# Altium project MKS_GEN_V14.PrjPCB
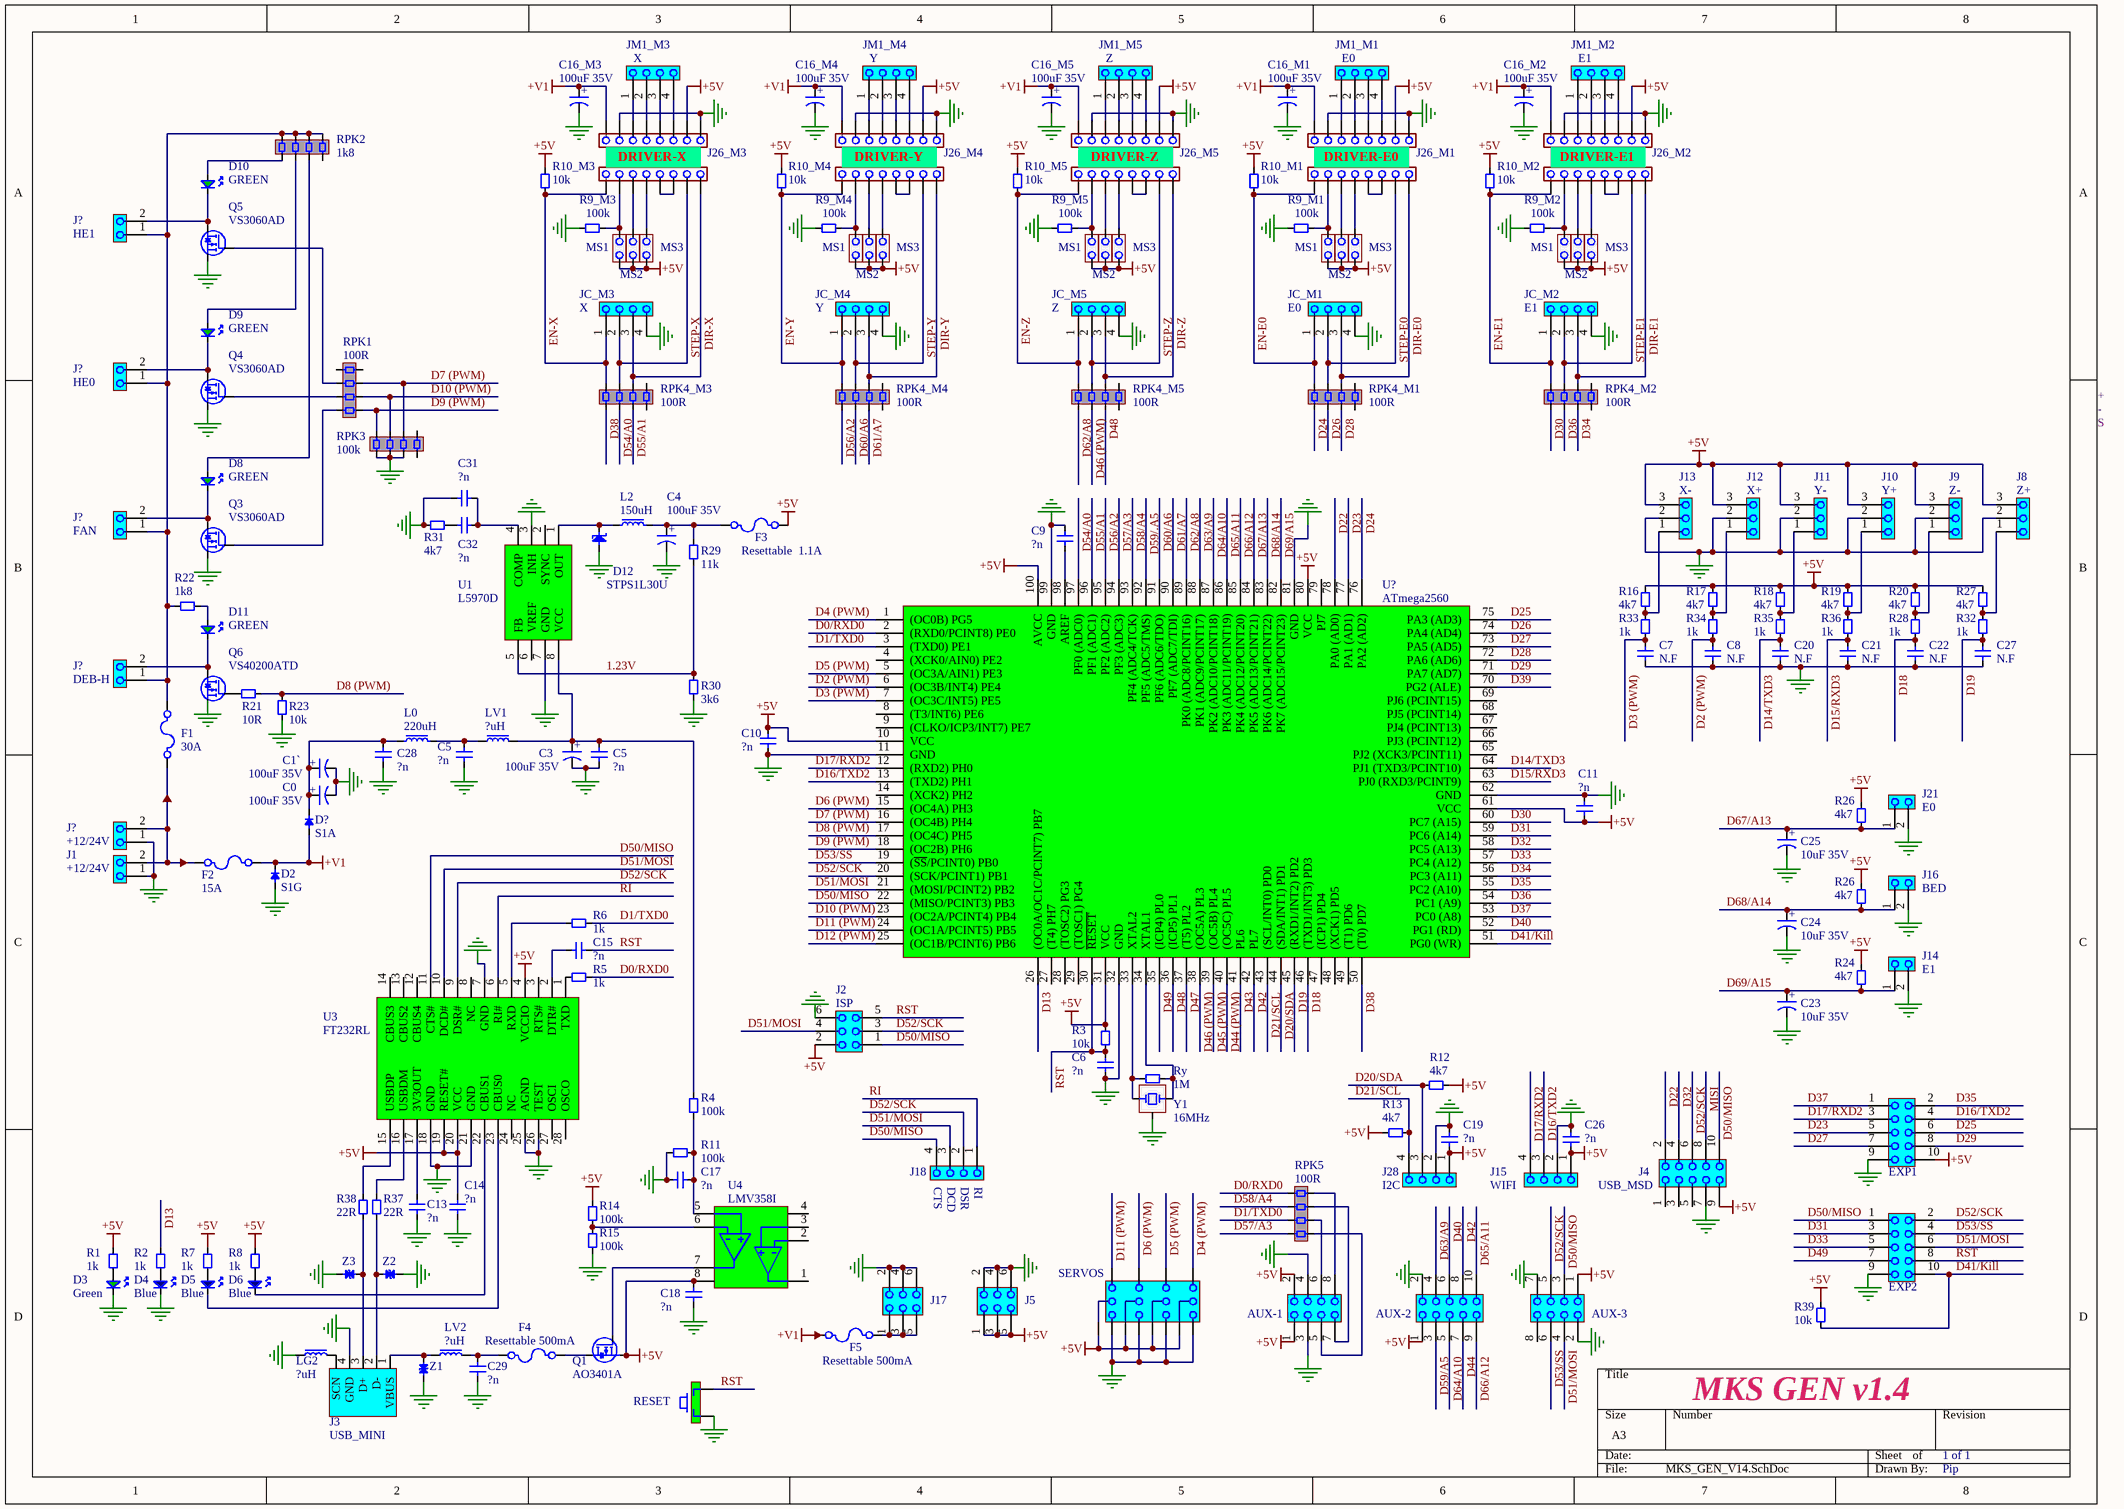
[diagram p0: MKS_GEN_V14.SchDoc]
1 sheet, 191 parts. Net scope: global (net labels, ports and power ports of the same name join across sheets).

## Sheet MKS_GEN_V14.SchDoc
size A3

### Parts
(Parts that share a designator on the sheet are numbered #1, #2 ... from top to bottom, then left to right.)
C0  100uF 35V
C1`  100uF 35V
C3  100uF 35V
C4  100uF 35V
C5#1  ?n  [CC0603]
C5#2  ?n  [CC0603]
C6  ?n  [CC0603]
C7  N.F  [CC0603]
C8  N.F  [CC0603]
C9  ?n  [CC0603]
C10  ?n  [CC0603]
C11  ?n  [CC0603]
C13  ?n  [CC0603]
C14  ?n  [CC0603]
C15  ?n  [CC0603]
C16_M1  100uF 35V  [Cap Case Code AVX C]
C16_M2  100uF 35V  [Cap Case Code AVX C]
C16_M3  100uF 35V  [Cap Case Code AVX C]
C16_M4  100uF 35V  [Cap Case Code AVX C]
C16_M5  100uF 35V  [Cap Case Code AVX C]
C17  ?n  [CC0603]
C18  ?n  [CC0603]
C19  ?n  [CC0603]
C20  N.F  [CC0603]
C21  N.F  [CC0603]
C22  N.F  [CC0603]
C23  10uF 35V
C24  10uF 35V
C25  10uF 35V
C26  ?n  [CC0603]
C27  N.F  [CC0603]
C28  ?n  [CC0603]
C29  ?n  [CC0603]
C31  ?n  [CC0603]
C32  ?n  [CC0603]
CONN?#1  EXP1
CONN?#2  EXP2
CONN?#3  SERVOS
CONN?#4  AUX-1
CONN?#5  AUX-2
CONN?#6  AUX-3
D2  S1G
D3  Green  [SMT_LED]
D4  Blue  [SMT_LED]
D5  Blue  [SMT_LED]
D6  Blue  [SMT_LED]
D8  GREEN  [SMT_LED]
D9  GREEN  [SMT_LED]
D10  GREEN  [SMT_LED]
D11  GREEN  [SMT_LED]
D12  STPS1L30U
D?  S1A
F1  30A
F2  15A
F3  Resettable  1.1A
F4  Resettable 500mA
F5  Resettable 500mA
J1  +12/24V
J2  ISP
J3  USB_MINI
J4  USB_MSD
J5  ?  (value not drawn)
J8  Z+
J9  Z-
J10  Y+
J11  Y-
J12  X+
J13  X-
J14  E1
J15  WIFI
J16  BED
J17  ?  (value not drawn)
J18  WIFI  (value not drawn)
J21  E0
J26_M1  Header 8 0.1  (value not drawn)
J26_M2  Header 8 0.1  (value not drawn)
J26_M3  Header 8 0.1  (value not drawn)
J26_M4  Header 8 0.1  (value not drawn)
J26_M5  Header 8 0.1  (value not drawn)
J28  I2C
J?#1  HE1
J?#2  HE0
J?#3  FAN
J?#4  DEB-H
J?#5  +12/24V
JC_M1  E0
JC_M2  E1
JC_M3  X
JC_M4  Y
JC_M5  Z
JM1_M1  E0
JM1_M2  E1
JM1_M3  X
JM1_M4  Y
JM1_M5  Z
JP?#1  Header 8 0.1  (value not drawn)
JP?#2  Header 8 0.1  (value not drawn)
JP?#3  Header 8 0.1  (value not drawn)
JP?#4  Header 8 0.1  (value not drawn)
JP?#5  Header 8 0.1  (value not drawn)
JP?#6  MS1  [sip2 - 0.1"]
JP?#7  MS2  [sip2 - 0.1"]
JP?#8  MS3  [sip2 - 0.1"]
JP?#9  MS1  [sip2 - 0.1"]
JP?#10  MS2  [sip2 - 0.1"]
JP?#11  MS3  [sip2 - 0.1"]
JP?#12  MS1  [sip2 - 0.1"]
JP?#13  MS2  [sip2 - 0.1"]
JP?#14  MS3  [sip2 - 0.1"]
JP?#15  MS1  [sip2 - 0.1"]
JP?#16  MS2  [sip2 - 0.1"]
JP?#17  MS3  [sip2 - 0.1"]
JP?#18  MS1  [sip2 - 0.1"]
JP?#19  MS2  [sip2 - 0.1"]
JP?#20  MS3  [sip2 - 0.1"]
L0  220uH  [Inductor CDRH3D11HPNP]
L2  150uH  [Inductor CDRH3D11HPNP]
LG2  ?uH  [Murata Coil]
LV1  ?uH  [Murata Coil]
LV2  ?uH  [Murata Coil]
Q1  AO3401A  [SOT-23]
Q3  VS3060AD
Q4  VS3060AD
Q5  VS3060AD
Q6  VS40200ATD
R1  1k  [RES603N]
R2  1k  [RES603N]
R3  10k  [RES603N]
R4  100k  [RES603N]
R5  1k  [RES603N]
R6  1k  [RES603N]
R7  1k  [RES603N]
R8  1k  [RES603N]
R9_M1  100k  [RES603N]
R9_M2  100k  [RES603N]
R9_M3  100k  [RES603N]
R9_M4  100k  [RES603N]
R9_M5  100k  [RES603N]
R10_M1  10k  [RES603N]
R10_M2  10k  [RES603N]
R10_M3  10k  [RES603N]
R10_M4  10k  [RES603N]
R10_M5  10k  [RES603N]
R11  100k  [RES603N]
R12  4k7  [RES603N]
R13  4k7  [RES603N]
R14  100k  [RES603N]
R15  100k  [RES603N]
R16  4k7  [RES603N]
R17  4k7  [RES603N]
R18  4k7  [RES603N]
R19  4k7  [RES603N]
R20  4k7  [RES603N]
R21  10R  [RES603N]
R22  1k8  [RES603N]
R23  10k  [RES603N]
R24  4k7  [RES603N]
R26#1  4k7  [RES603N]
R26#2  4k7  [RES603N]
R27  4k7  [RES603N]
R28  1k  [RES603N]
R29  11k  [RES603N]
R30  3k6  [RES603N]
R31  4k7  [RES603N]
R32  1k  [RES603N]
R33  1k  [RES603N]
R34  1k  [RES603N]
R35  1k  [RES603N]
R36  1k  [RES603N]
R37  22R  [RES603N]
R38  22R  [RES603N]
R39  10k  [RES603N]
RPK1  100R  [TC164]
RPK2  1k8  [TC164]
RPK3  100k  [TC164]
RPK4_M1  100R  [TC164]
RPK4_M2  100R  [TC164]
RPK4_M3  100R  [TC164]
RPK4_M4  100R  [TC164]
RPK4_M5  100R  [TC164]
RPK5  100R  [TC164]
Ry  1M  [RES603N]
SW??  RESET
U1  L5970D  [TSSOP8]
U3  FT232RL
U4  LMV358I  [SOIC8_N]
U?  ATmega2560
Y1  16MHz
Z1  ?  (value not drawn)
Z2  ?  (value not drawn)
Z3  ?  (value not drawn)

### Nets
+5V: C10.2 C11.1 C14.1 C18.2 C19.1 C26.1 CONN?#1.10 CONN?#4.1 CONN?#4.2 CONN?#5.1 CONN?#6.1 F3.2 J2.2 J4.9 J5.1 J5.3 J5.5 J8.3 J9.3 J10.3 J11.3 J12.3 J13.3 J15.1 J26_M1.7 J26_M2.7 J26_M3.7 J26_M4.7 J26_M5.7 J28.1 JP?#6.1 JP?#7.1 JP?#8.1 JP?#9.1 JP?#10.1 JP?#11.1 JP?#12.1 JP?#13.1 JP?#14.1 JP?#15.1 JP?#16.1 JP?#17.1 JP?#18.1 JP?#19.1 JP?#20.1 Q1.2(S) R1.2 R3.2 R7.2 R8.2 R10_M1.1 R10_M2.1 R10_M3.1 R10_M4.1 R10_M5.1 R12.2 R13.2 R14.1 R16.2 R17.2 R18.2 R19.2 R20.2 R24.2 R26#1.2 R26#2.2 R27.2 R39.2 U3.4(VCCIO) U3.19(RESET#) U3.20(VCC) U4.8(VCC) U?.10(VCC) U?.31(VCC) U?.61(VCC) U?.80(VCC) U?.100(AVCC)
+V1: C16_M1.1 C16_M2.1 C16_M3.1 C16_M4.1 C16_M5.1 D2.1 D?.2 F2.2 F5.1 J26_M1.1 J26_M2.1 J26_M3.1 J26_M4.1 J26_M5.1
GND: C0.2 C1`.2 C3.2 C4.2 C5#1.1 C5#2.1 C6.1 C7.1 C8.1 C9.2 C10.1 C11.2 C13.2 C14.2 C16_M1.2 C16_M2.2 C16_M3.2 C16_M4.2 C16_M5.2 C17.2 C18.1 C19.2 C20.1 C21.1 C22.1 C23.2 C24.2 C25.2 C26.2 C27.1 C28.1 C29.1 C31.2 CONN?#1.9 CONN?#2.9 CONN?#4.3 CONN?#4.4 CONN?#5.2 CONN?#6.2 CONN?#6.7 D2.2 D3.2(K) D4.2(K) D12.2(A) J1.1 J2.6 J3.4(GND) J4.7 J5.2 J5.4 J5.6 J8.2 J9.2 J10.2 J11.2 J12.2 J13.2 J14.2 J15.2 J16.2 J17.2 J17.4 J17.6 J21.2 J26_M1.2 J26_M1.8 J26_M2.2 J26_M2.8 J26_M3.2 J26_M3.8 J26_M4.2 J26_M4.8 J26_M5.2 J26_M5.8 J28.2 J?#5.1 JC_M1.4 JC_M2.4 JC_M3.4 JC_M4.4 JC_M5.4 LG2.1 Q3.1(S) Q4.1(S) Q5.1(S) R9_M1.1 R9_M2.1 R9_M3.1 R9_M4.1 R9_M5.1 R11.2 R15.2 R23.1 R30.1 R31.1 RPK3.6 RPK3.7 RPK3.8 SW??.1(N.C) U1.3(INH) U1.7(GND) U3.7(GND) U3.18(GND) U3.21(GND) U3.25(AGND) U3.26(TEST) U?.11(GND) U?.32(GND) U?.62(GND) U?.81(GND) U?.99(GND) Y1.2 Z1.1 Z2.2 Z3.1
1.23V: R29.1 R30.2 U1.5(FB)
D0/RXD0: R5.1 RPK5.4 U?.2((RXD0/PCINT8)_PE0)
D1/TXD0: R6.1 RPK5.2 U?.3((TXD0)_PE1)
D2 (PWM): C8.2 R34.1 U?.6((OC3B/INT4)_PE4)
D3 (PWM): C7.2 R33.1 U?.7((OC3C/INT5)_PE5)
D4 (PWM): CONN?#3.12 U?.1((OC0B)_PG5)
D5 (PWM): CONN?#3.9 U?.5((OC3A/AIN1)_PE3)
D6 (PWM): CONN?#3.6 U?.15((OC4A)_PH3)
D7 (PWM): RPK1.6 RPK3.3 U?.16((OC4B)_PH4)
D8 (PWM): R21.2 R23.2 U?.17((OC4C)_PH5)
D9 (PWM): RPK1.8 RPK3.1 U?.18((OC2B)_PH6)
D10 (PWM): RPK1.7 RPK3.2 U?.23((OC2A/PCINT4)_PB4)
D11 (PWM): CONN?#3.3 U?.24((OC1A/PCINT5)_PB5)
D12 (PWM): U?.25((OC1B/PCINT6)_PB6)
D13: R2.2 U?.26((OC0A/OC1C/PCINT7)_PB7)
D14/TXD3: C20.2 R35.1 U?.64(PJ1_(TXD3/PCINT10))
D15/RXD3: C21.2 R36.1 U?.63(PJ0_(RXD3/PCINT9))
D16/TXD2: CONN?#1.4 J15.3 U?.13((TXD2)_PH1)
D17/RXD2: CONN?#1.3 J15.4 U?.12((RXD2)_PH0)
D18: C22.2 R28.1 U?.46((TXD1/INT3)_PD3)
D19: C27.2 R32.1 U?.45((RXD1/INT2)_PD2)
D20/SDA: J28.3 R12.1 U?.44((SDA/INT1)_PD1)
D21/SCL: J28.4 R13.1 U?.43((SCL/INT0)_PD0)
D22: J4.2 U?.78(PA0_(AD0))
D23: CONN?#1.5 U?.77(PA1_(AD1))
D24: RPK4_M1.4 U?.76(PA2_(AD2))
D25: CONN?#1.6 U?.75(PA3_(AD3))
D26: RPK4_M1.3 U?.74(PA4_(AD4))
D27: CONN?#1.7 U?.73(PA5_(AD5))
D28: RPK4_M1.2 U?.72(PA6_(AD6))
D29: CONN?#1.8 U?.71(PA7_(AD7))
D30: RPK4_M2.4 U?.60(PC7_(A15))
D31: CONN?#2.3 U?.59(PC6_(A14))
D32: J4.4 U?.58(PC5_(A13))
D33: CONN?#2.5 U?.57(PC4_(A12))
D34: RPK4_M2.2 U?.56(PC3_(A11))
D35: CONN?#1.2 U?.55(PC2_(A10))
D36: RPK4_M2.3 U?.54(PC1_(A9))
D37: CONN?#1.1 U?.53(PC0_(A8))
D38: RPK4_M3.4 U?.50((T0)_PD7)
D39: U?.70(PG2_(ALE))
D40: CONN?#5.6 U?.52(PG1_(RD))
D41/Kill: CONN?#2.10 R39.1 U?.51(PG0_(WR))
D42: CONN?#5.8 U?.42(PL7)
D43: U?.41(PL6)
D44: CONN?#5.7
D44 (PWM): U?.40((OC5C)_PL5)
D45 (PWM): U?.39((OC5B)_PL4)
D46 (PWM): RPK4_M5.3 U?.38((OC5A)_PL3)
D47: U?.37((T5)_PL2)
D48: RPK4_M5.2 U?.36((ICP5)_PL1)
D49: CONN?#2.7 U?.35((ICP4)_PL0)
D50/MISO: CONN?#2.1 CONN?#6.3 J2.1 J4.10 J18.4 U3.11(CTS#) U?.22((MISO/PCINT3)_PB3)
D51/MOSI: CONN?#2.6 CONN?#6.4 J2.4 J18.3 U3.10(DCD#) U?.21((MOSI/PCINT2)_PB2)
D52/SCK: CONN?#2.2 CONN?#6.5 J2.3 J4.6 J18.2 U3.9(DSR#) U?.20((SCK/PCINT1)_PB1)
D53/SS: CONN?#2.4 CONN?#6.6 U?.19((~{SS}/PCINT0)_PB0)
D54/A0: RPK4_M3.3 U?.97(PF0_(ADC0))
D55/A1: RPK4_M3.2 U?.96(PF1_(ADC1))
D56/A2: RPK4_M4.4 U?.95(PF2_(ADC2))
D57/A3: RPK5.1 U?.94(PF3_(ADC3))
D58/A4: RPK5.3 U?.93(PF4_(ADC4/TCK))
D59/.A5: U?.92(PF5_(ADC5/TMS))
D59/A5: CONN?#5.3
D60/A6: RPK4_M4.3 U?.91(PF6_(ADC6/TDO))
D61/A7: RPK4_M4.2 U?.90(PF7_(ADC7/TDI))
D62/A8: RPK4_M5.4 U?.89(PK0_(ADC8/PCINT16))
D63/A9: CONN?#5.4 U?.88(PK1_(ADC9/PCINT17))
D64/A10: CONN?#5.5 U?.87(PK2_(ADC10/PCINT18))
D65/A11: CONN?#5.10 U?.86(PK3_(ADC11/PCINT19))
D66/A12: CONN?#5.9 U?.85(PK4_(ADC12/PCINT20))
D67/A13: C25.1 J21.1 R26#1.1 U?.84(PK5_(ADC13/PCINT21))
D68/A14: C24.1 J16.1 R26#2.1 U?.83(PK6_(ADC14/PCINT22))
D69/A15: C23.1 J14.1 R24.1 U?.82(PK7_(ADC15/PCINT23))
DIR-E0: JC_M1.3 JP?#4.8 RPK4_M1.7
DIR-E1: JC_M2.3 JP?#5.8 RPK4_M2.7
DIR-X: JC_M3.3 JP?#1.8 RPK4_M3.7
DIR-Y: JC_M4.3 JP?#2.8 RPK4_M4.7
DIR-Z: JC_M5.3 JP?#3.8 RPK4_M5.7
EN-E0: JC_M1.1 JP?#4.1 R10_M1.2 RPK4_M1.5
EN-E1: JC_M2.1 JP?#5.1 R10_M2.2 RPK4_M2.5
EN-X: JC_M3.1 JP?#1.1 R10_M3.2 RPK4_M3.5
EN-Y: JC_M4.1 JP?#2.1 R10_M4.2 RPK4_M4.5
EN-Z: JC_M5.1 JP?#3.1 R10_M5.2 RPK4_M5.5
MISI: J4.8
RI: J18.1 U3.6(RI#)
RST: C6.2 C15.1 CONN?#2.8 J2.5 R3.1 SW??.2 U?.30(~{RESET})
STEP-E0: JC_M1.2 JP?#4.7 RPK4_M1.6
STEP-E1: JC_M2.2 JP?#5.7 RPK4_M2.6
STEP-X: JC_M3.2 JP?#1.7 RPK4_M3.6
STEP-Y: JC_M4.2 JP?#2.7 RPK4_M4.6
STEP-Z: JC_M5.2 JP?#3.7 RPK4_M5.6
NetC0_1: C0.1 C1`.1 C28.2 D?.1 L0.1
NetC3_1: C3.1 C5#2.2 LV1.2 R4.2 U1.8(VCC)
NetC4_1: C4.1 F3.1 L2.2 R29.2
NetC5#1_2: C5#1.2 L0.2 LV1.1
NetC9_1: C9.1 U?.98(AREF)
NetC13_1: C13.1 U3.17(3V3OUT)
NetC15_2: C15.2 U3.2(DTR#)
NetC17_1: C17.1 R4.1 R11.1 U4.5(NC)
NetC29_2: C29.2 F4.1 LV2.2
NetC31_1: C31.1 C32.1 U1.4(COMP)
NetC32_2: C32.2 R31.2
NetCONN?#4_5: CONN?#4.5 RPK5.8
NetCONN?#4_6: CONN?#4.6 RPK5.7
NetCONN?#4_7: CONN?#4.7 RPK5.6
NetCONN?#4_8: CONN?#4.8 RPK5.5
NetD3_1: D3.1(A) R1.1
NetD4_1: D4.1(A) R2.1
NetD5_1: D5.1(A) R7.1
NetD5_2: D5.2(K) U3.23(CBUS0)
NetD6_1: D6.1(A) R8.1
NetD6_2: D6.2(K) U3.22(CBUS1)
NetD8_1: D8.1(A) RPK2.6
NetD8_2: D8.2(K) J?#3.2 Q3.3(D)
NetD9_1: D9.1(A) RPK2.7
NetD9_2: D9.2(K) J?#2.2 Q4.3(D)
NetD10_1: D10.1(A) RPK2.8
NetD10_2: D10.2(K) J?#1.2 Q5.3(D)
NetD11_1: D11.1(A) R22.2
NetD11_2: D11.2(K) J?#4.2 Q6.3(D)
NetD12_1: D12.1(K) L2.1 U1.1(OUT)
NetF1_1: F1.1 F2.1 J1.2 J?#5.2
NetF1_2: F1.2 J?#1.1 J?#2.1 J?#3.1 J?#4.1 R22.1 RPK2.1 RPK2.2 RPK2.3 RPK2.4
NetF4_2: F4.2 Q1.1(D)
NetF5_2: F5.2 J17.1 J17.3 J17.5
NetJ3_0: J3.0(SCN) LG2.2
NetJ3_1: J3.1(VBUS) LV2.1 Z1.2
NetJ3_2: J3.2(D-) R37.2 Z2.1
NetJ3_3: J3.3(D+) R38.2 Z3.2
NetJ8_1: J8.1 R27.1 R32.2
NetJ9_1: J9.1 R20.1 R28.2
NetJ10_1: J10.1 R19.1 R36.2
NetJ11_1: J11.1 R18.1 R35.2
NetJ12_1: J12.1 R17.1 R34.2
NetJ13_1: J13.1 R16.1 R33.2
NetJ26_M1_3: J26_M1.3 JM1_M1.1
NetJ26_M1_4: J26_M1.4 JM1_M1.2
NetJ26_M1_5: J26_M1.5 JM1_M1.3
NetJ26_M1_6: J26_M1.6 JM1_M1.4
NetJ26_M2_3: J26_M2.3 JM1_M2.1
NetJ26_M2_4: J26_M2.4 JM1_M2.2
NetJ26_M2_5: J26_M2.5 JM1_M2.3
NetJ26_M2_6: J26_M2.6 JM1_M2.4
NetJ26_M3_3: J26_M3.3 JM1_M3.1
NetJ26_M3_4: J26_M3.4 JM1_M3.2
NetJ26_M3_5: J26_M3.5 JM1_M3.3
NetJ26_M3_6: J26_M3.6 JM1_M3.4
NetJ26_M4_3: J26_M4.3 JM1_M4.1
NetJ26_M4_4: J26_M4.4 JM1_M4.2
NetJ26_M4_5: J26_M4.5 JM1_M4.3
NetJ26_M4_6: J26_M4.6 JM1_M4.4
NetJ26_M5_3: J26_M5.3 JM1_M5.1
NetJ26_M5_4: J26_M5.4 JM1_M5.2
NetJ26_M5_5: J26_M5.5 JM1_M5.3
NetJ26_M5_6: J26_M5.6 JM1_M5.4
NetJP?#1_2: JP?#1.2 JP?#6.2 R9_M3.2
NetJP?#1_3: JP?#1.3 JP?#7.2
NetJP?#1_4: JP?#1.4 JP?#8.2
NetJP?#1_5: JP?#1.5 JP?#1.6
NetJP?#2_2: JP?#2.2 JP?#9.2 R9_M4.2
NetJP?#2_3: JP?#2.3 JP?#10.2
NetJP?#2_4: JP?#2.4 JP?#11.2
NetJP?#2_5: JP?#2.5 JP?#2.6
NetJP?#3_2: JP?#3.2 JP?#12.2 R9_M5.2
NetJP?#3_3: JP?#3.3 JP?#13.2
NetJP?#3_4: JP?#3.4 JP?#14.2
NetJP?#3_5: JP?#3.5 JP?#3.6
NetJP?#4_2: JP?#4.2 JP?#15.2 R9_M1.2
NetJP?#4_3: JP?#4.3 JP?#16.2
NetJP?#4_4: JP?#4.4 JP?#17.2
NetJP?#4_5: JP?#4.5 JP?#4.6
NetJP?#5_2: JP?#5.2 JP?#18.2 R9_M2.2
NetJP?#5_3: JP?#5.3 JP?#19.2
NetJP?#5_4: JP?#5.4 JP?#20.2
NetJP?#5_5: JP?#5.5 JP?#5.6
NetQ1_3: Q1.3(G) U4.7(OUT2)
NetQ3_2: Q3.2(G) RPK1.1
NetQ4_2: Q4.2(G) RPK1.2
NetQ5_2: Q5.2(G) RPK1.3
NetQ6_2: Q6.2(G) R21.1
NetR5_2: R5.2 U3.1(TXD)
NetR6_2: R6.2 U3.5(RXD)
NetR14_2: R14.2 R15.1 U4.6(-2)
NetR37_1: R37.1 U3.16(USBDM)
NetR38_1: R38.1 U3.15(USBDP)
NetRy_1: Ry.1 U?.33(XTAL2) Y1.1
NetRy_2: Ry.2 U?.34(XTAL1) Y1.3

Not connected (* = marked no-connect by the designer): CONN?#3 1 2 4 5 7 8 10 11; CONN?#6 8; J4 1 3 5; Q6 1(S); RPK1 4 5; RPK2 5; RPK3 4 5; RPK4_M1 1 8; RPK4_M2 1 8; RPK4_M3 1 8; RPK4_M4 1 8; RPK4_M5 1 8; SW?? 4(N.C) 8(N.C) 9(N.C) 14(N.C); U1 2(SYNC) 6(VREF); U3 3(RTS#) 8(NC) 12(CBUS4) 13(CBUS2) 14(CBUS3) 24(NC) 27(OSCI) 28(OSCO); U4 1(OUT1) 2(-1) 3(+1) 4(VSS); U? 4((XCK0/AIN0)_PE2) 8((T3/INT6)_PE6) 9((CLKO/ICP3/INT7)_PE7) 14((XCK2)_PH2) 27((T4)_PH7) 28((TOSC2)_PG3) 29((TOSC1)_PG4) 47((ICP1)_PD4) 48((XCK1)_PD5) 49((T1)_PD6) 65(PJ2_(XCK3/PCINT11)) 66(PJ3_(PCINT12)) 67(PJ4_(PCINT13)) 68(PJ5_(PCINT14)) 69(PJ6_(PCINT15)) 79(PJ7)

### Notes on the sheet
- DRIVER-X
- DRIVER-Y
- DRIVER-Z
- DRIVER-E0
- DRIVER-E1
- S
- -
- +
- (near J18) CTS
- (near J18) DCD
- (near J18) DSR
- (near J18) RI
- (near R39) MKS GEN v1.4
- 1 of 1
- Pip
- Labels drawn without touching a wire or pin: GND
- (in symbol CAP 10uF_2) +
- (in symbol CAP 470uF) +
- (in symbol CAP 1000uF_35V) +

### Library data of the parts
C0 C1` C3 C4 = CAP 1000uF_35V: Capacitor
C5#1 C5#2 C6-C11 C13-C15 C17-C22 C26-C29 C31 C32 = Cap: Capacitor; Manufacturer: Generic Components; Class: Passive; Published: 08/06/2000; Publisher: Altium Hobart Technology Centre; SubClass: Capacitor
C16_M1-C16_M5 = CAP 470uF: Capacitor
C23-C25 = CAP 10uF_2: Capacitor
CONN?#1 CONN?#2 CONN?#5 J4 = Header 5x2: Manufacturer: Generic Components; Class: Connector
CONN?#3 = Header 3x4: Header, 3x4; Manufacturer: Generic Components; Class: Connector
CONN?#4 CONN?#6 = Header 4x2_1: Header 4x2; Manufacturer: Generic Components; Class: Connector
D2 = S1G: Diode 1A; Supplier 1: Digi-Key
D3 D8-D11 = LED_SMT_GREEN: LED SMT GREEN, Digikey 754-1121-1-ND; Manufacturer: Generic Components; Class: Discrete
D4-D6 = LED_SMT_BLUE: LED SMT BLUE, Digikey 754-1119-1-ND; Manufacturer: Generic Components; Class: Discrete
D12 = STPS1L30U: DIODE SCHOTTKY 30V 1A; RoHS: RoHS Compliant; Category: Discrete Semiconductor Products; Diode Type: Schottky; Mounting Type: Surface Mount; Packaging: Cut Tape (CT)
D? = S1A: Diode 1A; Supplier 1: Digi-Key
F1-F5 = FUSE: Manufacturer: Generic Components; Class: Passive
J1 J14 J16 J21 J?#1-J?#5 = Header 2x1: Header 2-Pin; Manufacturer: Generic Components; Class: Connector
J2 J5 J17 = Header 3x2: Header 6-Pin; Manufacturer: Generic Components; Class: Connector
J3 = USB_MINI_SKT: USB Mini Socket; Class: Connector; Supplier 1: Digi-Key
J8-J13 = Header 3x1: Header 3-Pin; Manufacturer: Generic Components; Class: Connector
J15 J18 J28 JC_M1-JC_M5 JM1_M1-JM1_M5 = Header 4: Header, 4-Pin; Manufacturer: Generic Components; Class: Connector
J26_M1-J26_M5 JP?#1-JP?#5 = Header 8 0.1: Header, 8-Pin, 0.1"; Manufacturer: Generic Components; Class: Connector
JP?#6-JP?#20 = Jumper2: Jumper, 2-Pin, 0.1"; Manufacturer: Generic Components; Class: Connector
L0 L2 = Inductor_10uH_600: Inductor 10uH 600mA Digikey 308-1966-2-ND; Manufacturer: Generic Components; Class: Passive
LG2 LV1 LV2 = Inductor_10uH: Inductor 10uH 200mA Digikey 490-4990-1-ND; Class: Passive; SubClass: Inductor
Q1 = AO3401A: P-Channel MOSFET 30V 4A; Manufacturer: Generic Components; Class: Passive
Q3-Q5 = VS3060AD: N-Channel MOSFET 30V 60A 9mR
Q6 = VS40200ATD: N-Channel MOSFET 40V 200A 3mR
R1-R8 R9_M1-R9_M5 R10_M1-R10_M5 R11-R24 R26#1 R26#2 R27-R39 Ry = RES_0603: Resistor; Manufacturer: Generic Components; Class: Passive; SubClass: Resistor
RPK1-RPK3 RPK4_M1-RPK4_M5 RPK5 = RESISTOR_ARRAY_1k: 4 Resistor Array, Digikey TC164J-1.0KCT-ND; Class: Passive; SubClass: Resistor; Supplier 1: Digi-Key; Supplier Part Number 1: TC164J-1.0KCT-ND
SW?? = SW1: Push button switch
U1 = L5970D: Step Down Buck Regulator 1A 1.25V to 35V Output
U3 = FT232RL: USB Serial port FT232RL
U4 = LMV358I: Dual OPAMP
U? = ATmega2560_2
Y1 = XTAL SMT: Surface Mount Quartz Crystal; Class: Oscillator; SubClass: Crystal Oscillator; Supplier 1: Digi-Key; Supplier Part Number 1: 535-9720-1-ND
Z1-Z3 = Z_DIODE: Diode Array